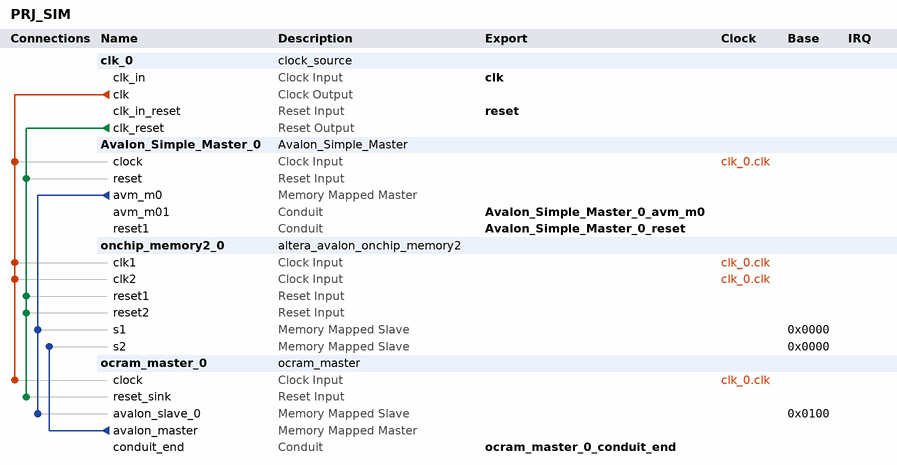
[diagram p0: system contents]
# Platform Designer (Qsys) system PRJ_SIM, Cyclone V 5CSXFC6D6F31C8ES
# Parameters at their usual value, and those the tool derives, are not listed.
package require -exact qsys 17.1
create_system PRJ_SIM
set_project_property DEVICE_FAMILY {Cyclone V}
set_project_property DEVICE 5CSXFC6D6F31C8ES

add_instance clk_0 clock_source 17.1
set_instance_parameter_value clk_0 clockFrequency 50000000

add_instance Avalon_Simple_Master_0 Avalon_Simple_Master 1.0

add_instance onchip_memory2_0 altera_avalon_onchip_memory2 17.1
set_instance_parameter_value onchip_memory2_0 dataWidth 32
set_instance_parameter_value onchip_memory2_0 dualPort true
set_instance_parameter_value onchip_memory2_0 enableDiffWidth true
set_instance_parameter_value onchip_memory2_0 initMemContent true
set_instance_parameter_value onchip_memory2_0 initializationFileName onchip_mem.hex
set_instance_parameter_value onchip_memory2_0 memorySize 256

add_instance ocram_master_0 ocram_master 1.0

# connections
add_connection clk_0.clk Avalon_Simple_Master_0.clock clock
add_connection clk_0.clk ocram_master_0.clock clock
add_connection clk_0.clk onchip_memory2_0.clk1 clock
add_connection clk_0.clk onchip_memory2_0.clk2 clock
add_connection clk_0.clk_reset Avalon_Simple_Master_0.reset reset
add_connection clk_0.clk_reset ocram_master_0.reset_sink reset
add_connection clk_0.clk_reset onchip_memory2_0.reset1 reset
add_connection clk_0.clk_reset onchip_memory2_0.reset2 reset
add_connection Avalon_Simple_Master_0.avm_m0 ocram_master_0.avalon_slave_0 avalon
set_connection_parameter_value Avalon_Simple_Master_0.avm_m0/ocram_master_0.avalon_slave_0 baseAddress 0x0100
add_connection Avalon_Simple_Master_0.avm_m0 onchip_memory2_0.s1 avalon
set_connection_parameter_value Avalon_Simple_Master_0.avm_m0/onchip_memory2_0.s1 baseAddress 0x0000
add_connection ocram_master_0.avalon_master onchip_memory2_0.s2 avalon
set_connection_parameter_value ocram_master_0.avalon_master/onchip_memory2_0.s2 baseAddress 0x0000

# exported interfaces
add_interface Avalon_Simple_Master_0_avm_m0 conduit end
set_interface_property Avalon_Simple_Master_0_avm_m0 EXPORT_OF Avalon_Simple_Master_0.avm_m01
add_interface Avalon_Simple_Master_0_reset conduit end
set_interface_property Avalon_Simple_Master_0_reset EXPORT_OF Avalon_Simple_Master_0.reset1
add_interface clk clock sink
set_interface_property clk EXPORT_OF clk_0.clk_in
add_interface ocram_master_0_conduit_end conduit end
set_interface_property ocram_master_0_conduit_end EXPORT_OF ocram_master_0.conduit_end
add_interface reset reset sink
set_interface_property reset EXPORT_OF clk_0.clk_in_reset

set_interconnect_requirement {$system} qsys_mm.clockCrossingAdapter HANDSHAKE
set_interconnect_requirement {$system} qsys_mm.enableEccProtection FALSE
set_interconnect_requirement {$system} qsys_mm.insertDefaultSlave FALSE
set_interconnect_requirement {$system} qsys_mm.maxAdditionalLatency 1

save_system PRJ_SIM.qsys
